# EAGLE design TPS6122x (EAGLE 7.5.0)
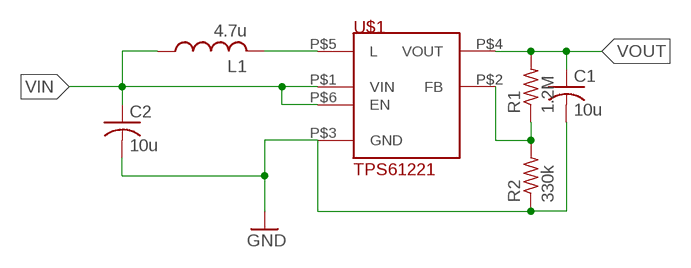
[diagram p0: schematic, sheet 1]

## Parts
C1  10u  C-USC3216  [C3216]
C2  10u  C-USC3216  [C3216]
L1  4.7u  L-USL1210  [L1210]
R1  1.2M  R-US_R0603  [R0603]
R2  330k  R-US_R0603  [R0603]
U$1  TPS61221  [TPS61221]

## Nets
GND: C1.2 C2.2 R2.1 U$1.P$3(GND)
N$1: L1.2 U$1.P$5(L)
N$4: R1.1 R2.2 U$1.P$2(FB)
VIN: C2.1 L1.1 U$1.P$1(VIN) U$1.P$6(EN)
VOUT: C1.1 R1.2 U$1.P$4(VOUT)

## Library data of the parts
C1 C2 = rcl:C-US: CAPACITOR, American symbol
L1 = rcl-2:L-US: INDUCTOR, American symbol
R1 R2 = rcl:R-US_: RESISTOR, American symbol
U$1 = tps6122x:TPS61221

## Board
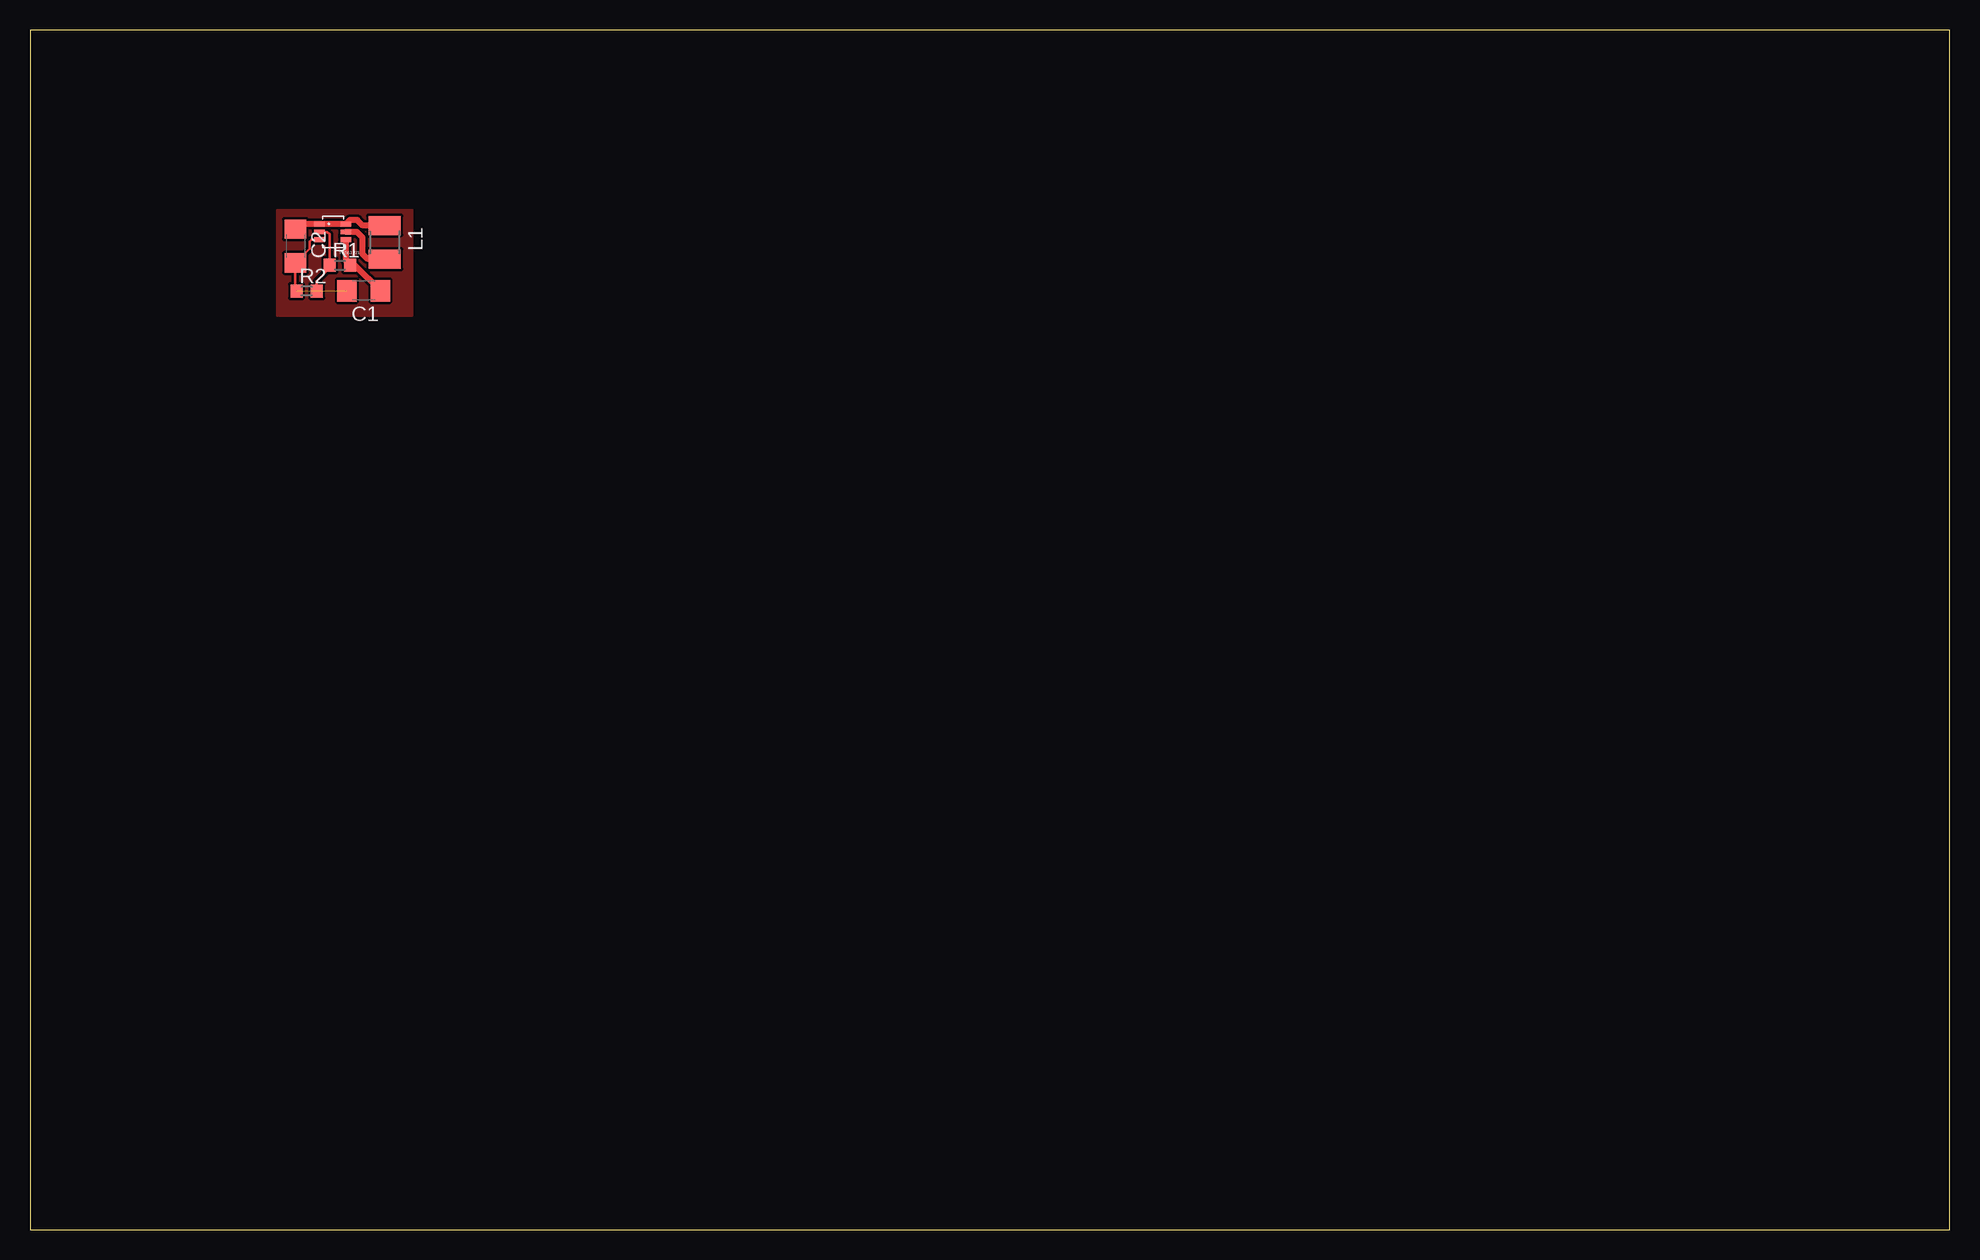
[diagram p1: board, top side]

Size 160 x 100 mm. Coordinates in mm from the lower left corner, seen from the top.
Outline: 0,0 160,0 160,100 0,100 0,0
Copper layers (1*16): Top 0.035mm / dielectric 1.5mm / Bottom 0.035mm
Design rules "default": minimum track width 10mil, minimum drill 24mil, track to track 8mil, track to pad 8mil, pad to pad 8mil, via to via 8mil, smd to smd 8mil, copper to edge 40mil, drill to drill 8mil, minimum pad ring 10mil, minimum via ring 8mil, stop-mask expansion 4mil, vias tented up to drill 0mil, thermal gap 10mil

### Footprints (pad centres in the part's own frame; a part is rotated, then mirrored left to right if it is on the bottom)
C3216 = smd 1.6 x 1.8: 1 -1.4,0; 2 1.4,0
L1210 = smd 1.6 x 2.7: 1 -1.4,0; 2 1.4,0
R0603 = smd 1 x 1.1: 1 -0.85,0; 2 0.85,0
TPS61221 = smd 0.9 x 0.4: P$1 0,0; P$2 0,-0.65; P$3 0,-1.3; P$4 2.2,-1.3; P$5 2.2,-0.65; P$6 2.2,0

### Placement (x,y rotation side)
C1  27.81,78.26 180 top
C2  22.12,81.99 270 top
L1  29.57,82.3 270 top
R1  25.83,80.39 0 top
R2  23.06,78.23 0 top
U$1  24.13,83.82 0 top

### Tracks (layer width: path | path; a pad name or v marks a point on that pad's centre or on a via)
GND  (1 unrouted)
  Top 0.203: U$1.P$3 23.49,82.52 23.32,82.35 23.32,81.78 C2.2 22.12,78.32 R2.1
N$1
  Top 0.508: L1.2 28.15,80.9 27.71,81.33 27.71,82.7 27.25,83.16 U$1.P$5
N$2
  pour Top: 20.62,84.99 31.85,84.99 31.85,76.17 20.62,76.17
N$4
  Top 0.203: U$1.P$2 24.79,83.16 24.98,82.97 R1.1 24.98,80.15 23.9,79.07 23.9,78.24 R2.2
VIN
  Top 0.508: L1.1 27.73,83.7 27.28,84.15 26.66,84.15 U$1.P$6 U$1.P$1 22.55,83.82 C2.1
VOUT
  Top 0.203: 26.33,80.74 R1.2
  Top 0.508: U$1.P$4 26.33,80.74 | R1.2 27.08,80.39 C1.1